# EAGLE design untitled (EAGLE 6.3)
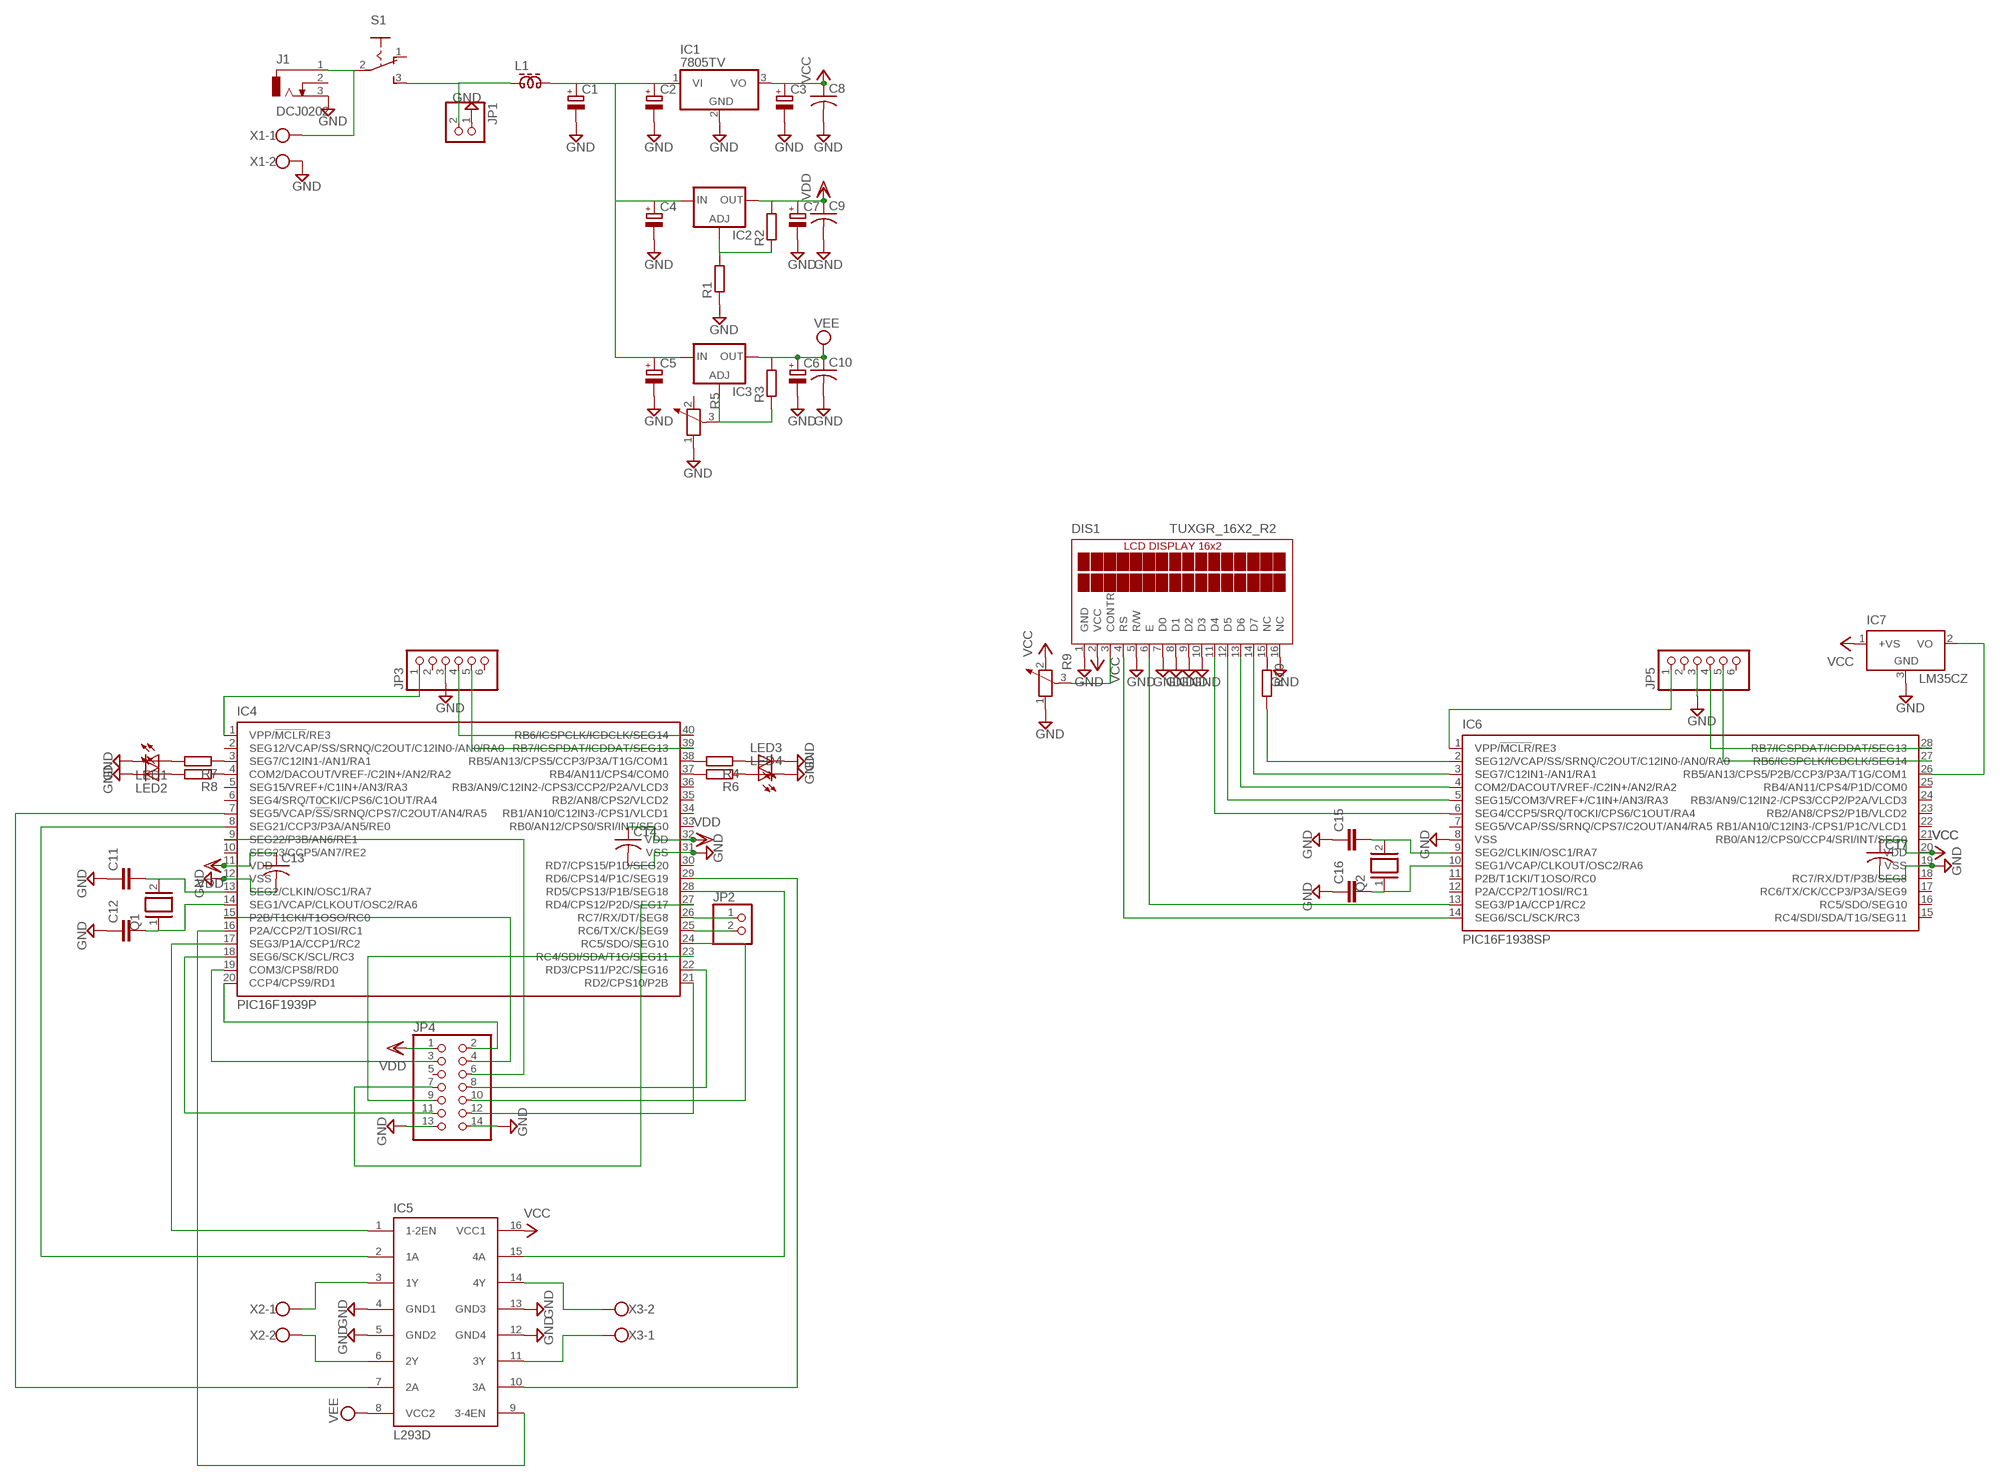
[diagram p0: schematic, sheet 1]

## Parts
C1  CPOL-EUE5-13  [E5-13]
C2  CPOL-EUE3.5-8  [E3,5-8]
C3  CPOL-EUE3.5-8  [E3,5-8]
C4  CPOL-EUE3.5-8  [E3,5-8]
C5  CPOL-EUE3.5-8  [E3,5-8]
C6  CPOL-EUE5-13  [E5-13]
C7  CPOL-EUE3.5-8  [E3,5-8]
C8  C-US050-030X075  [C050-030X075]
C9  C-US050-030X075  [C050-030X075]
C10  C-US050-030X075  [C050-030X075]
C11  C-EU025-025X050  [C025-025X050]
C12  C-EU025-025X050  [C025-025X050]
C13  C-US050-030X075  [C050-030X075]
C14  C-US050-030X075  [C050-030X075]
C15  C-EU025-025X050  [C025-025X050]
C16  C-EU025-025X050  [C025-025X050]
C17  C-US050-030X075  [C050-030X075]
DIS1  TUXGR_16X2_R2  [TUXGR_16X2_R2]
IC1  7805TV  [TO220V]
IC2  LM317TS  [317TS]
IC3  LM317TS  [317TS]
IC4  PIC16F1939P  [DIL40]
IC5  L293D  [DIL16]
IC6  PIC16F1938SP  [DIL28-3]
IC7  LM35CZ  [TO92]
J1  DCJ0202  [DCJ0202]
JP1  PINHD-1X2  [1X02]
JP2  PINHD-1X2  [1X02]
JP3  PINHD-1X6  [1X06]
JP4  PINHD-2X7  [2X07]
JP5  PINHD-1X6  [1X06]
L1  ZD60820512  [ZD6-2W5]
LED1  LED5MM  [LED5MM]
LED2  LED5MM  [LED5MM]
LED3  LED5MM  [LED5MM]
LED4  LED5MM  [LED5MM]
Q1  XTAL/S  [QS]
Q2  XTAL/S  [QS]
R1  R-EU_0207/10  [0207/10]
R2  R-EU_0207/10  [0207/10]
R3  R-EU_0207/10  [0207/10]
R4  R-EU_0207/10  [0207/10]
R5  POTENTIOMETER_PT-10  [PT-10]
R6  R-EU_0207/10  [0207/10]
R7  R-EU_0207/10  [0207/10]
R8  R-EU_0207/10  [0207/10]
R9  POTENTIOMETER_PT-10  [PT-10]
R10  R-EU_0207/10  [0207/10]
S1  255SB  [255SB]
X1  W237-102  [W237-102]
X2  W237-102  [W237-102]
X3  W237-102  [W237-102]

## Nets
GND: C1.- C2.- C3.- C4.- C5.- C6.- C7.- C8.2 C9.2 C10.2 C11.1 C12.1 C13.2 C14.2 C15.1 C16.1 C17.2 DIS1.1(GND) DIS1.5(R/W) DIS1.7(D0) DIS1.8(D1) DIS1.9(D2) DIS1.10(D3) DIS1.16(NC) IC1.2(GND) IC4.12(VSS) IC4.31(VSS) IC5.4(GND1) IC5.5(GND2) IC5.12(GND4) IC5.13(GND3) IC6.8(VSS) IC6.19(VSS) IC7.3(GND) J1.3 JP1.1 JP3.3 JP4.13 JP4.14 JP5.3 LED1.K(C) LED2.K(C) LED3.K(C) LED4.K(C) R1.1 R5.1 R9.1 X1.2
N$1: JP1.2 L1.1 S1.3(S)
N$2: IC4.17(SEG3/P1A/CCP1/RC2) IC5.1(1-2EN)
N$3: IC3.1(ADJ) R3.1 R5.3
N$4: J1.1 S1.2(P) X1.1
N$5: C1.+ C2.+ C4.+ C5.+ IC1.1(VI) IC2.3(IN) IC3.3(IN) L1.2
N$6: IC4.26(RC7/RX/DT/SEG8) JP2.1
N$7: IC4.25(RC6/TX/CK/SEG9) JP2.2
N$8: IC2.1(ADJ) R1.2 R2.1
N$9: IC4.24(RC5/SDO/SEG10) JP4.10
N$10: IC4.1(VPP/!MCLR!/RE3) JP3.1
N$11: IC4.40(RB6/ICSPCLK/ICDCLK/SEG14) JP3.4
N$12: IC4.39(RB7/ICSPDAT/ICDDAT/SEG13) JP3.5
N$13: C12.2 IC4.14(SEG1/VCAP/CLKOUT/OSC2/RA6) Q1.1
N$14: C11.2 IC4.13(SEG2/CLKIN/OSC1/RA7) Q1.2
N$15: IC4.23(RC4/SDI/SDA/T1G/SEG11) JP4.9
N$16: IC4.18(SEG6/SCK/SCL/RC3) JP4.11
N$17: IC4.16(P2A/CCP2/T1OSI/RC1) IC5.9(3-4EN)
N$18: IC4.20(CCP4/CPS9/RD1) JP4.2
N$19: IC4.19(COM3/CPS8/RD0) JP4.3
N$20: IC4.15(P2B/T1CKI/T1OSO/RC0) JP4.4
N$21: IC4.9(SEG22/P3B/AN6/RE1) JP4.6
N$22: IC4.27(RD4/CPS12/P2D/SEG17) JP4.7
N$23: IC4.21(RD2/CPS10/P2B) JP4.12
N$24: IC4.22(RD3/CPS11/P2C/SEG16) JP4.8
N$25: IC4.38(RB5/AN13/CPS5/CCP3/P3A/T1G/COM1) R4.2
N$26: IC4.37(RB4/AN11/CPS4/COM0) R6.2
N$27: IC4.3(SEG7/C12IN1-/AN1/RA1) R7.1
N$28: LED1.A R7.2
N$29: IC4.4(COM2/DACOUT/VREF-/C2IN+/AN2/RA2) R8.1
N$30: LED2.A R8.2
N$31: LED3.A R4.1
N$32: LED4.A R6.1
N$33: IC6.1(VPP/!MCLR!/RE3) JP5.1
N$34: IC4.28(RD5/CPS13/P1B/SEG18) IC5.15(4A)
N$35: IC4.29(RD6/CPS14/P1C/SEG19) IC5.10(3A)
N$36: IC4.8(SEG21/CCP3/P3A/AN5/RE0) IC5.2(1A)
N$37: IC4.7(SEG5/VCAP/!SS!/SRNQ/CPS7/C2OUT/AN4/RA5) IC5.7(2A)
N$38: IC5.3(1Y) X2.1
N$39: IC5.6(2Y) X2.2
N$40: IC5.14(4Y) X3.2
N$41: IC5.11(3Y) X3.1
N$42: IC6.28(RB7/ICSPDAT/ICDDAT/SEG13) JP5.4
N$43: IC6.27(RB6/ICSPCLK/ICDCLK/SEG14) JP5.5
N$44: C16.2 IC6.10(SEG1/VCAP/CLKOUT/OSC2/RA6) Q2.1
N$45: IC6.26(RB5/AN13/CPS5/P2B/CCP3/P3A/T1G/COM1) IC7.2(VO)
N$46: IC6.2(SEG12/VCAP/SS/SRNQ/C2OUT/C12IN0-/AN0/RA0) R10.2
N$47: DIS1.3(CONTR) R9.3
N$48: DIS1.14(D7) IC6.3(SEG7/C12IN1-/AN1/RA1)
N$49: DIS1.13(D6) IC6.4(COM2/DACOUT/VREF-/C2IN+/AN2/RA2)
N$50: DIS1.12(D5) IC6.5(SEG15/COM3/VREF+/C1IN+/AN3/RA3)
N$51: DIS1.11(D4) IC6.6(SEG4/CCP5/SRQ/T0CKI/CPS6/C1OUT/RA4)
N$52: DIS1.6(E) IC6.13(SEG3/P1A/CCP1/RC2)
N$53: DIS1.4(RS) IC6.14(SEG6/SCL/SCK/RC3)
N$54: DIS1.15(NC) R10.1
N$56: C15.2 IC6.9(SEG2/CLKIN/OSC1/RA7) Q2.2
VCC: C3.+ C8.1 C17.1 DIS1.2(VCC) IC1.3(VO) IC5.16(VCC1) IC6.20(VDD) IC7.1(+VS) R9.2
VDD: C7.+ C9.1 C13.1 C14.1 IC2.2(OUT) IC4.11(VDD) IC4.32(VDD) JP4.1 R2.2
VEE: C6.+ C10.1 IC3.2(OUT) IC5.8(VCC2) R3.2
Unconnected: IC4.2(SEG12/VCAP/SS/SRNQ/C2OUT/C12IN0-/AN0/RA0) IC4.5(SEG15/VREF+/C1IN+/AN3/RA3) IC4.6(SEG4/SRQ/T0CKI/CPS6/C1OUT/RA4) IC4.10(SEG23/CCP5/AN7/RE2) IC4.30(RD7/CPS15/P1D/SEG20) IC4.33(RB0/AN12/CPS0/SRI/INT/SEG0) IC4.34(RB1/AN10/C12IN3-/CPS1/VLCD1) IC4.35(RB2/AN8/CPS2/VLCD2) IC4.36(RB3/AN9/C12IN2-/CPS3/CCP2/P2A/VLCD3) IC6.7(SEG5/VCAP/SS/SRNQ/CPS7/C2OUT/AN4/RA5) IC6.11(P2B/T1CKI/T1OSO/RC0) IC6.12(P2A/CCP2/T1OSI/RC1) IC6.15(RC4/SDI/SDA/T1G/SEG11) IC6.16(RC5/SDO/SEG10) IC6.17(RC6/TX/CK/CCP3/P3A/SEG9) IC6.18(RC7/RX/DT/P3B/SEG8) IC6.21(RB0/AN12/CPS0/CCP4/SRI/INT/SEG0) IC6.22(RB1/AN10/C12IN3-/CPS1/P1C/VLCD1) IC6.23(RB2/AN8/CPS2/P1B/VLCD2) IC6.24(RB3/AN9/C12IN2-/CPS3/CCP2/P2A/VLCD3) IC6.25(RB4/AN11/CPS4/P1D/COM0) J1.2 JP3.2 JP3.6 JP4.5 JP5.2 JP5.6 R5.2 S1.1(O)

## Library data of the parts
C1-C7 = rcl:CPOL-EU: POLARIZED CAPACITOR, European symbol
C8-C10 C13 C14 C17 = resistor:C-US: CAPACITOR, American symbol
C11 C12 C15 C16 = rcl:C-EU: CAPACITOR, European symbol
DIS1 = display-lcd:TUXGR_16X2_R2: Tuxgraphics LCD display 16x2 characters reflective, without background light Source: tuxgr_12x2_r2.pdf; OC_FARNELL: unknown; OC_NEWARK: unknown
IC1 = linear:78*: Positive LDO VOLTAGE REGULATOR Source: http://ww1.microchip.com/downloads/en/DeviceDoc/21983A.pdf
IC2 IC3 = v-reg:LM317TS: VOLTAGE REGULATOR
IC4 = microchip:PIC16F193*?: Flash-Based, 8-Bit CMOS Microcontrollers wtih LCD Driver and nanoWatt XLP Technology Auto generated by make-symbol-device-package-bsdl.ulp Rev. 33 Source: http://ww1.microchip.com/downloads/en/DeviceDoc/41364D.pdf; MPN: PIC16F1939-I/P; OC_FARNELL: 1755832; OC_NEWARK: 08R1958
IC5 = st-microelectronics:L293D: PUSH-PULL 4 CHANNEL DRIVER; MPN: L293D; OC_FARNELL: 9589619; OC_NEWARK: 56P8249
IC6 = microchip:PIC16F19*: Flash-Based, 8-Bit CMOS Microcontrollers wtih LCD Driver and nanoWatt XLP Technology Auto generated by make-symbol-device-package-bsdl.ulp Rev. 33 Source: http://ww1.microchip.com/downloads/en/DeviceDoc/41364D.pdf; MPN: PIC16F1938-I/SP; OC_FARNELL: 1755829; OC_NEWARK: 08R1949
IC7 = lm35:LM35: Single-Supply Centigrade Temperature Sensor Vout = (10mV/°C x Temp °C) +5mmmV Source: http://www.national.com/ds/LM/LM35.pdf
J1 = con-jack:DCJ0202: DC POWER JACK Source: DCJ0202.pdf; OC_FARNELL: unknown; OC_NEWARK: unknown
JP1 JP2 = pinhead:PINHD-1X2: PIN HEADER
JP3 JP5 = pinhead:PINHD-1X6: PIN HEADER
JP4 = pinhead:PINHD-2X7: PIN HEADER
L1 = inductor-neosid:ZD60820512: WIDE-BAND CHOKE 2.5 windings; OC_FARNELL: unknown; OC_NEWARK: unknown
LED1-LED4 = led:LED: LED OSRAM: - CHIPLED LG R971, LG N971, LY N971, LG Q971, LY Q971, LO R971, LY R971 LH N974, LH R974 LS Q976, LO Q976, LY Q976 LO Q996 - Hyper CHIPLED LW Q18S LB Q993, LB Q99A, LB R99A - SideLED LS A670, LO A670, LY A670, LG A670, LP A670 LB A673, LV A673, LT A673, LW A673 LH A674 LY A675 LS A676, LA A676, LO A676, LY A676, LW A676 LS A679, LY A679, LG A679 - Hyper Micro SIDELED® LS Y876, LA Y876, LO Y876, LY Y876 LT Y87S - SmartLED LW L88C, LW L88S LB L89C, LB L89S, LG L890 LS L89K, LO L89K, LY L89K LS L896, LA L896, LO L896, LY L896 - TOPLED LS T670, LO T670, LY T670, LG T670, LP T670 LSG T670, LSP T670, LSY T670, LOP T670, LYG T670 LG T671, LOG T671, LSG T671 LB T673, LV T673, LT T673, LW T673 LH T674 LS T676, LA T676, LO T676, LY T676, LB T676, LH T676, LSB T676, LW T676 LB T67C, LV T67C, LT T67C, LS T67K, LO T67K, LY T67K, LW E67C LS E67B, LA E67B, LO E67B, LY E67B, LB E67C, LV E67C, LT E67C LW T67C LS T679, LY T679, LG T679 LS T770, LO T770, LY T770, LG T770, LP T770 LB T773, LV T773, LT T773, LW T773 LH T774 LS E675, LA E675, LY E675, LS T675 LS T776, LA T776, LO T776, LY T776, LB T776 LHGB T686 LT T68C, LB T68C - Hyper Mini TOPLED® LB M676 - Mini TOPLED Santana® LG M470 LS M47K, LO M47K, LY M47K Source: http://www.osram.convergy.de LUXEON: - LUMILED® LXK2-PW12-R00, LXK2-PW12-S00, LXK2-PW14-U00, LXK2-PW14-V00 LXK2-PM12-R00, LXK2-PM12-S00, LXK2-PM14-U00 LXK2-PE12-Q00, LXK2-PE12-R00, LXK2-PE12-S00, LXK2-PE14-T00, LXK2-PE14-U00 LXK2-PB12-K00, LXK2-PB12-L00, LXK2-PB12-M00, LXK2-PB14-N00, LXK2-PB14-P00, LXK2-PB14-Q00 LXK2-PR12-L00, LXK2-PR12-M00, LXK2-PR14-Q00, LXK2-PR14-R00 LXK2-PD12-Q00, LXK2-PD12-R00, LXK2-PD12-S00 LXK2-PH12-R00, LXK2-PH12-S00 LXK2-PL12-P00, LXK2-PL12-Q00, LXK2-PL12-R00 Source: www.luxeon.com KINGBRIGHT: KA-3528ASYC Source: www.kingbright.com
Q1 Q2 = special:XTAL/S: CRYSTAL
R1-R4 R6-R8 R10 = resistor:R-EU_: RESISTOR, European symbol
R5 R9 = rcl:POTENTIOMETER_: Potentiometer
S1 = switch:255SB: SLIDING SWITCH Distributor Buerklin, 11G810
X1-X3 = con-wago-500:W237-102: WAGO SCREW CLAMP; MPN: 237-102; OC_FARNELL: unknown; OC_NEWARK: 70K9898

## Board
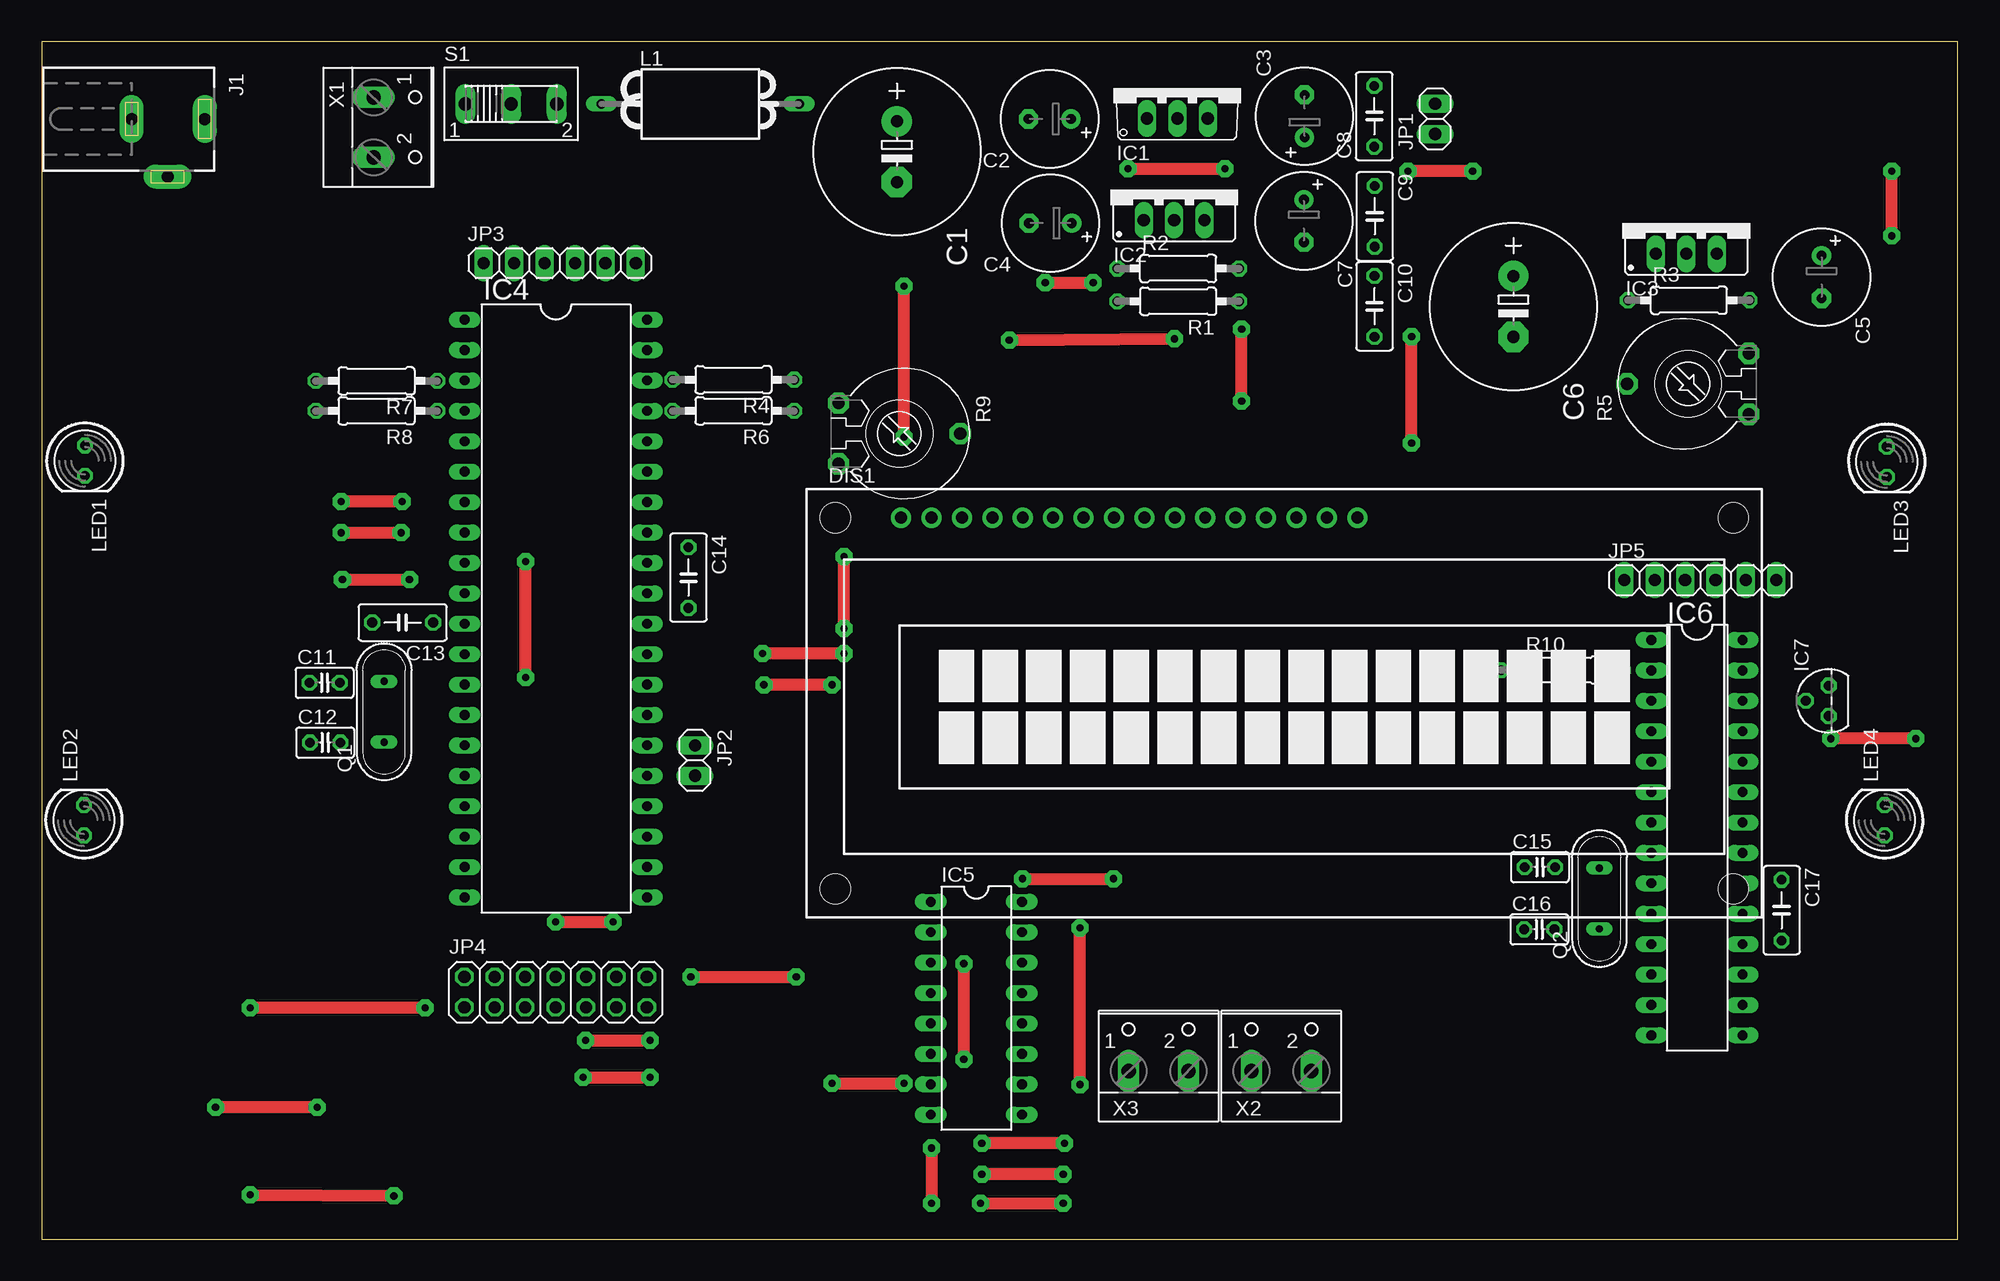
[diagram p1: board, top side]
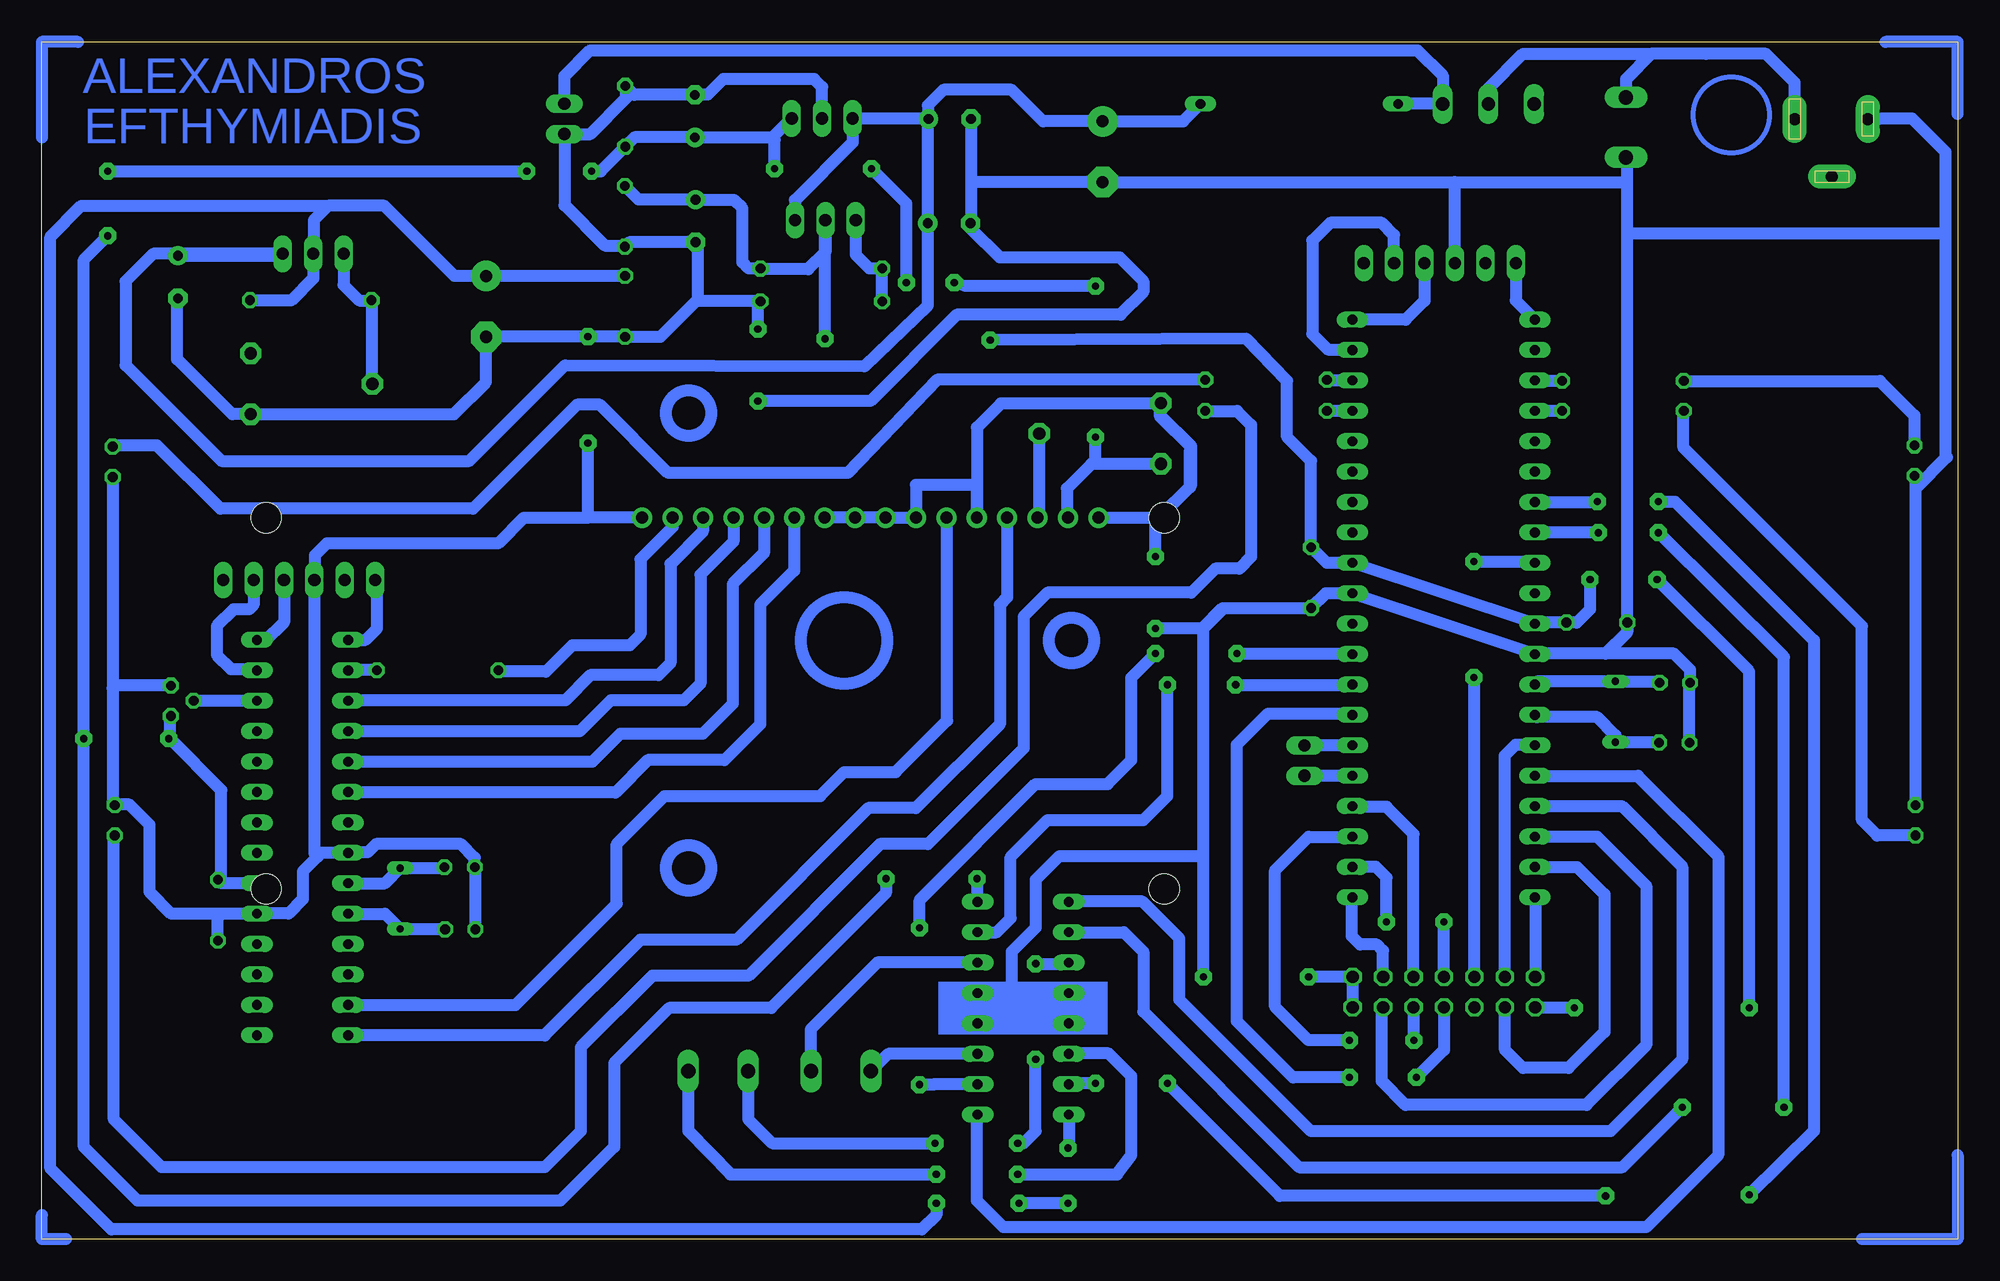
[diagram p2: board, bottom side, seen from below]

Size 160 x 100 mm. Coordinates in mm from the lower left corner, seen from the top.
Outline: 0,0 160,0 160,100 0,100 0,0
Copper layers (1*16): Top 0.035mm / dielectric 1.5mm / Bottom 0.035mm
Design rules "default": minimum track width 10mil, minimum drill 24mil, track to track 8mil, track to pad 8mil, pad to pad 8mil, via to via 8mil, smd to smd 8mil, copper to edge 40mil, drill to drill 8mil, minimum pad ring 10mil, minimum via ring 8mil, stop-mask expansion 4mil, vias tented up to drill 0mil, thermal gap 10mil

### Footprints (pad centres in the part's own frame; a part is rotated, then mirrored left to right if it is on the bottom)
E5-13 = drill 1.016 pad 2.54: + -2.54,0 | drill 1.016 pad 2.54 octagon: - 2.54,0
E3,5-8 = drill 0.813 pad 1.6: + -1.778,0 | drill 0.813 pad 1.6 octagon: - 1.778,0
C050-030X075 = drill 0.813 octagon: 1 -2.54,0; 2 2.54,0
C025-025X050 = drill 0.813 octagon: 1 -1.27,0; 2 1.27,0
TUXGR_16X2_R2 = drill 1 pad 1.676: 1 -32,15.5; 2 -29.46,15.5; 3 -26.92,15.5; 4 -24.38,15.5; 5 -21.84,15.5; 6 -19.3,15.5; 7 -16.76,15.5; 8 -14.22,15.5; 9 -11.68,15.5; 10 -9.14,15.5; 11 -6.6,15.5; 12 -4.06,15.5; 13 -1.52,15.5; 14 1.02,15.5; 15 3.56,15.5; 16 6.1,15.5 | hole 2.5: -37.5,-15.5; 37.5,-15.5; -37.5,15.5; 37.5,15.5
TO220V = drill 1.016 long: 1 -2.54,-2.54; 2 0,-2.54; 3 2.54,-2.54
317TS = drill 1.016 long: 1 -2.54,-2.54; 2 0,-2.54; 3 2.54,-2.54
DIL40 = drill 0.813 long: 1 -24.13,-7.62; 2 -21.59,-7.62; 3 -19.05,-7.62; 4 -16.51,-7.62; 5 -13.97,-7.62; 6 -11.43,-7.62; 7 -8.89,-7.62; 8 -6.35,-7.62; 9 -3.81,-7.62; 10 -1.27,-7.62; 11 1.27,-7.62; 12 3.81,-7.62; 13 6.35,-7.62; 14 8.89,-7.62; 15 11.43,-7.62; 16 13.97,-7.62; 17 16.51,-7.62; 18 19.05,-7.62; 19 21.59,-7.62; 20 24.13,-7.62; 21 24.13,7.62; 22 21.59,7.62; 23 19.05,7.62; 24 16.51,7.62; 25 13.97,7.62; 26 11.43,7.62; 27 8.89,7.62; 28 6.35,7.62; 29 3.81,7.62; 30 1.27,7.62; 31 -1.27,7.62; 32 -3.81,7.62; 33 -6.35,7.62; 34 -8.89,7.62; 35 -11.43,7.62; 36 -13.97,7.62; 37 -16.51,7.62; 38 -19.05,7.62; 39 -21.59,7.62; 40 -24.13,7.62
DIL16 = drill 0.813 long: 1 -8.89,-3.81; 2 -6.35,-3.81; 3 -3.81,-3.81; 4 -1.27,-3.81; 5 1.27,-3.81; 6 3.81,-3.81; 7 6.35,-3.81; 8 8.89,-3.81; 9 8.89,3.81; 10 6.35,3.81; 11 3.81,3.81; 12 1.27,3.81; 13 -1.27,3.81; 14 -3.81,3.81; 15 -6.35,3.81; 16 -8.89,3.81
DIL28-3 = drill 0.813 long: 1 -16.51,-3.81; 2 -13.97,-3.81; 3 -11.43,-3.81; 4 -8.89,-3.81; 5 -6.35,-3.81; 6 -3.81,-3.81; 7 -1.27,-3.81; 8 1.27,-3.81; 9 3.81,-3.81; 10 6.35,-3.81; 11 8.89,-3.81; 12 11.43,-3.81; 13 13.97,-3.81; 14 16.51,-3.81; 15 16.51,3.81; 16 13.97,3.81; 17 11.43,3.81; 18 8.89,3.81; 19 6.35,3.81; 20 3.81,3.81; 21 1.27,3.81; 22 -1.27,3.81; 23 -3.81,3.81; 24 -6.35,3.81; 25 -8.89,3.81; 26 -11.43,3.81; 27 -13.97,3.81; 28 -16.51,3.81
TO92 = drill 0.813 octagon: 1 -1.27,0; 2 0,1.905; 3 1.27,0
DCJ0202 = drill 1 pad 2 long: 1 0,3.1; 2 4.8,0; 3 0,-3
1X02 = drill 1.016 long: 1 -1.27,0; 2 1.27,0
1X06 = drill 1.016 long: 1 -6.35,0; 2 -3.81,0; 3 -1.27,0; 4 1.27,0; 5 3.81,0; 6 6.35,0
2X07 = drill 1.016 octagon: 1 -7.62,-1.27; 2 -7.62,1.27; 3 -5.08,-1.27; 4 -5.08,1.27; 5 -2.54,-1.27; 6 -2.54,1.27; 7 0,-1.27; 8 0,1.27; 9 2.54,-1.27; 10 2.54,1.27; 11 5.08,-1.27; 12 5.08,1.27; 13 7.62,-1.27; 14 7.62,1.27
ZD6-2W5 = drill 0.8 long: 1 -8.255,0; 2 8.255,0
LED5MM = drill 0.813 octagon: A -1.27,0; K 1.27,0
QS = drill 0.61 long: 1 -2.54,0; 2 2.54,0
0207/10 = drill 0.813 octagon: 1 -5.08,0; 2 5.08,0
PT-10 = drill 1.016 pad 1.778 octagon: 1 -2.54,-5.08; 2 2.54,-5.08; 3 0,5.08
255SB = drill 1.118 long: 1 -3.81,0; 2 0,0; 3 3.81,0
W237-102 = drill 1.194 long: 1 -2.5,-1.27; 2 2.5,-1.27

### Placement (x,y rotation side)
C1  71.41,90.83 270 top
C2  84.17,93.56 180 top
C3  105.46,93.8 90 top
C4  84.23,84.86 180 top
C5  148.64,80.36 270 top
C6  122.9,77.9 270 top
C7  105.4,85.05 270 top
C8  111.28,93.79 90 top
C9  111.32,85.43 270 top
C10  111.3,77.91 270 top
C11  23.61,46.47 0 top
C12  23.66,41.47 0 top
C13  30.13,51.5 180 top
C14  54,55.25 270 top
C15  125.11,31.07 0 top
C16  125.06,25.87 0 top
C17  145.3,27.47 270 top
DIS1  103.76,44.75 0 top
IC1  94.83,96.15 0 top
IC2  94.57,87.64 0 top
IC3  137.34,84.84 0 top
IC4  42.93,52.67 270 top
IC5  78.04,19.28 270 top
IC6  138.24,33.53 270 top
IC7  149.23,44.96 90 top
J1  10.5,93.56 270 top
JP1  116.36,93.58 90 top
JP2  54.54,39.97 270 top
JP3  43.25,81.52 0 top
JP4  42.9,20.63 0 top
JP5  138.51,55.04 0 top
L1  54.98,94.83 0 top
LED1  3.59,65.02 270 top
LED2  3.51,34.98 90 top
LED3  154.09,64.92 270 top
LED4  153.91,34.98 90 top
Q1  28.58,44.05 90 top
Q2  130.08,28.45 90 top
R1  94.9,78.33 180 top
R2  94.9,81.07 0 top
R3  137.55,78.42 0 top
R4  57.75,71.78 180 top
R5  137.48,71.44 90 top
R6  57.75,69.18 180 top
R7  27.95,71.68 180 top
R8  27.95,69.18 180 top
R9  71.62,67.29 270 top
R10  126.95,47.52 0 top
S1  39.19,94.83 0 top
X1  28.97,92.86 270 top
X2  103.52,15.31 0 top
X3  93.26,15.31 0 top

### Tracks (layer width: path | path; a pad name or v marks a point on that pad's centre or on a via)
GND  (via drill 0.6 pad 1.42)
  Top 1: v54.2,21.9 v63,21.9 | v67,51 v67,57 | v114.4,66.5 v114.4,75.37 | v100.2,70 v100.2,76
  Bottom 1: 82.39,88 C2.- 82.39,84.39 80,82 70,82 68,80 68,79.1 69.9,77.2 83.6,77.2 90.8,70 v100.2,70 | 82.39,88 82.39,84.92 C4.- | 82.39,88 82.1,88.29 C1.- 42,88.29 | 105.35,78.35 108.33,75.37 C10.2 v114.4,75.37 C6.- 122.9,71.6 125.6,68.9 R5.1 144.1,68.9 148.7,73.5 148.7,78.52 C5.- | 105.35,78.35 105.2,78.5 105.2,83.07 C7.- 110.94,83.27 C9.2 111.43,83 113,83 116.36,86.36 JP1.1 114.19,92.31 111.2,95.3 111.2,96.25 C8.2 110.53,95.58 C3.- 105.44,95.6 104.4,95.6 103.1,96.9 95.5,96.9 94.83,96.23 IC1.2 | 105.35,78.35 105.33,78.33 R1.1 100.2,78.11 v100.2,76 | C13.2 27.59,50.71 27.6,50.7 | 29.4,48.9 35.27,48.9 | 35.27,48.9 IC4.12 IC4.31 | IC4.31 52.77,53.94 C14.2 61.4,52.7 | C12.1 22.39,46.42 C11.1 22.34,47.54 23.7,48.9 29.4,48.9 | JP4.13 JP4.14 v54.2,21.9 | IC4.31 35.4,48.9 35.27,48.9 | 29.4,48.9 27.6,50.7 | 27.6,50.7 27.6,84 | 27.6,84 27.6,88 | 27.6,88 27.6,90.26 X1.2 | IC5.4 79,20.55 | 79,20.55 IC5.13 IC5.12 | IC5.5 IC5.4 | v63,21.9 63,32 | 63,32 63,51 | 63,51 63,51.1 61.4,52.7 | IC5.4 76.95,20.55 77,20.6 | 63,32 75,32 77,30 77,26 79,24 79,20.55 | LED1.K 3.51,63.67 LED2.K 3.51,62.69 0.9,65.3 1,65.4 1,84 | J1.3 7,93.56 | 7,93.56 6.56,93.56 | 1,84 27.6,84 | LED3.K 154.09,46 | 154.09,46 154.09,36.43 LED4.K 153.86,36.3 152.7,36.3 151,34.6 151,29 149.18,27.18 145,27.18 | 145,27.18 IC6.19 142.03,27.2 139.4,27.2 138.2,28.4 138.2,30.7 136.95,31.95 | 136.95,31.95 136.64,32.26 IC6.8 134.39,32.3 132.8,32.3 132.1,33 125,33 123.84,31.84 C15.1 123.79,31.02 C16.1 | 136.95,31.95 137.24,32.24 JP5.3 137.2,55.08 137.2,57.1 136.2,58.1 121.9,58.1 119.75,60.25 114.4,60.25 | C17.2 145.3,26.88 145,27.18 | IC7.3 153.86,46.23 154.09,46
  Bottom 1: 42,88.29 27.89,88.29 27.6,88 | JP3.3 41.98,88.27 42,88.29 | 1,84 1,90.8 3.8,93.6 6.96,93.6 7,93.56 | DIS1.10 DIS1.9 DIS1.8 DIS1.7 | 86.86,60.39 DIS1.7 | 67,60.25 66.75,60.25 | 66.75,60.25 64,63 64,66 | 64,66 64,66.1 | 64,66.1 66.6,68.7 66.6,68.8 | 66.6,69.7 66.6,69.77 R9.1 | DIS1.1 67,60.25 | 66.75,60.25 66.65,60.25 64.1,62.8 64.1,65.9 64,66 | 64,66.1 64,66.2 66.6,68.8 | 66.6,68.8 66.6,69.7 | 66.6,69.7 66.5,69.8 79.9,69.8 81.9,67.8 81.9,60.27 DIS1.5 81.92,62.92 82,63 87,63 DIS1.7 | 61.4,52.7 61.4,52.6 63,51 | 63,51 v67,51 | v67,57 67,60.25 | DIS1.16 114.4,60.25 | 114.4,60.25 v114.4,66.5
N$1
  Bottom 1: L1.1 S1.3 43,97.2 45.1,99.3 114.2,99.3 116.36,97.14 JP1.2
N$2
  Bottom 1: IC4.17 28.06,36.16 23,31.1 23,15 29,9 54,9 65,20 65,25.1 68.1,28.2 74.2,28.2 IC5.1
N$3
  Bottom 1: R5.3 132.47,71.51 R3.1 132.49,78.4 133.5,78.4 134.8,79.7 IC3.1
N$4
  Bottom 1: J1.1 13.6,96.6 16,99 21,99 25.6,99 | 25.6,99 27.7,96.9 X1.1 | S1.2 39.19,96.11 36.3,99 25.6,99
N$5
  Bottom 1: L1.2 64.69,93.37 C1.+ 76.37,93.37 79,96 84.7,96 86,94.7 86,93.61 C2.+ | C2.+ 86.01,93.5 C4.+ 86,78 91.3,72.9 116.3,73 124.3,65 145,65 153,73 153,80 150.7,82.3 IC3.3 140.04,82.14 C5.+ | C2.+ 86,93.61 IC1.1 92.29,91.61 97.1,86.8 IC2.3
N$6
  Bottom 1: IC4.26 JP2.1
N$7
  Bottom 1: IC4.25 JP2.2
N$8
  Bottom 1: IC2.1 92.03,82.23 90.9,81.1 89.85,81.1 R2.1 R1.2
N$9
  Bottom 1: JP4.10 45.44,33.84 47.7,36.1 50.49,36.1 IC4.24
N$10
  Bottom 1: JP3.1 36.9,78.39 IC4.1
N$11
  Bottom 1: JP3.4 44.52,78.38 46.1,76.8 IC4.40
N$12
  Bottom 1: JP3.5 47.06,83.86 48.1,84.9 52.4,84.9 53.9,83.4 53.9,75.6 52.6,74.3 50.59,74.3 IC4.39
N$13
  Bottom 1: IC4.14 35.13,43.6 30.1,43.6 28.58,42.08 Q1.1 28.54,41.47 C12.2
N$14
  Bottom 1: IC4.13 35.04,46.59 Q1.2 25,46.59 C11.2
N$15  (via drill 0.6 pad 1.42)
  Top 1: v45.4,16.6 v50.8,16.6
  Bottom 1: JP4.9 45.44,16.64 v45.4,16.6 | v50.8,16.6 54.2,16.6 57,19.4 57,30.8 54.2,33.6 50.57,33.6 IC4.23
N$16
  Bottom 1: IC4.18 30.12,33.62 26,29.5 26,16.2 31,11.2 46.1,11.2 48.1,13.2 48.1,19.24 JP4.11
N$17
  Bottom 1: IC4.16 26.7,38.7 20,32 20,7 26,1 79.7,1 81.9,3.2 81.9,10.34 IC5.9
N$18
  Bottom 1: IC4.20 35.28,28.54 JP4.2
N$19
  Bottom 1: IC4.19 31.78,31.08 29.5,28.8 29.5,17.3 32.5,14.3 36.3,14.3 37.8,15.8 37.8,19.34 JP4.3
N$20
  Bottom 1: JP4.4 37.82,40.38 36.9,41.3 35.37,41.3 IC4.15
N$21  (via drill 0.6 pad 1.42)
  Top 1: v40.4,46.9 v40.4,56.6
  Bottom 1: JP4.6 40.36,46.86 v40.4,46.9 | v40.4,56.6 35.43,56.6 IC4.9
N$22  (via drill 0.6 pad 1.42)
  Top 1: v45.2,13.5 v50.8,13.5
  Bottom 1: JP4.7 42.9,15.8 v45.2,13.5 | v50.8,13.5 55.5,13.5 60.2,18.2 60.2,41.3 57.6,43.9 50.67,43.9 IC4.27
N$23
  Bottom 1: JP4.12 47.98,24.08 48.5,24.6 49.9,24.6 50.6,25.3 50.6,28.49 IC4.21
N$24  (via drill 0.6 pad 1.42)
  Top 1: v42.9,26.5 v47.7,26.5
  Bottom 1: JP4.8 v42.9,26.5 | v47.7,26.5 47.7,30.2 48.6,31.1 50.53,31.1 IC4.22
N$25
  Bottom 1: IC4.38 52.61,71.72 R4.2
N$26
  Bottom 1: IC4.37 R6.2
N$27
  Bottom 1: R7.1 35.27,71.68 IC4.3
N$28
  Bottom 1: R7.2 6.48,71.68 3.6,68.8 LED1.A
N$29
  Bottom 1: R8.1 IC4.4
N$30
  Bottom 1: LED2.A 6.71,33.71 8,35 8,51.2 22.9,66.1 22.9,69.15 R8.2
N$31
  Bottom 1: R4.1 85.22,71.78 92.7,64 107.7,64 113.4,69.7 115.3,69.7 124,61 145.1,61 150.4,66.3 153.98,66.3 LED3.A
N$32
  Bottom 1: LED4.A 154,33.62 154,10 150,6 118,6 115,9 115,16 109,22 101,22 90,33 86,33 78,41 78,52 76,54 64,54 62,56 60,56 59,57 59,68 60.18,69.18 R6.1
N$33
  Bottom 1: IC6.1 132.96,50.04 132,51 132,54.88 JP5.1
N$34  (via drill 0.6 pad 1.42)
  Top 1: v66,46.3 v60.3,46.3
  Bottom 1: IC5.15 80.27,25.63 79.1,26.8 79.1,31.9 76,35 68,35 66,37 v66,46.3 | v60.3,46.3 50.57,46.3 IC4.28
N$35  (via drill 0.6 pad 1.42)
  Top 1: v86.7,12.9 v86.7,26 | v67,48.9 v60.2,48.9
  Bottom 1: IC5.10 85.47,12.93 85.5,12.9 v86.7,12.9 | v86.7,26 86.7,28.3 77,38 71,38 69,40 69,46.9 v67,48.9 | v60.2,48.9 50.59,48.9 IC4.29
N$36  (via drill 0.6 pad 1.42)
  Top 1: v23,11 v14.5,11 | v25,59 v30,59
  Bottom 1: IC5.2 69.63,25.63 68,24 68,19 55,6 28,6 v23,11 | v14.5,11 14.5,48.6 v25,59 | v30,59 35.29,59 IC4.8
N$37  (via drill 0.6 pad 1.42)
  Top 1: v30.1,61.6 v25,61.6 | v17.4,3.7 v29.4,3.6 | v66,13 v72,13
  Bottom 1: IC4.7 30.14,61.56 v30.1,61.6 | v25,61.6 23.6,61.6 12,50 12,9 v17.4,3.7 | v29.4,3.6 56.6,3.6 v66,13 | v72,13 74.16,13 IC5.7
N$38  (via drill 0.6 pad 1.42)
  Top 1: v85.4,8 v78.5,8 | v77,15 v77,23
  Bottom 1: X2.1 101.02,10.02 99,8 v85.4,8 | v78.5,8 78,8 77,9 v77,15 | v77,23 74.32,23 IC5.3
N$39  (via drill 0.6 pad 1.42)
  Top 1: v85.3,5.4 v78.5,5.4
  Bottom 1: X2.2 106.02,9.02 102.5,5.4 v85.3,5.4 | v78.5,5.4 70.2,5.4 69,7 69,13.6 70.9,15.5 74.2,15.5 IC5.6
N$40
  Bottom 1: IC5.14 90.21,23.09 95.8,17.5 95.8,14.08 X3.2
N$41
  Bottom 1: IC5.11 89.33,15.47 X3.1
N$42
  Bottom 1: JP5.4 139.78,51.52 141.4,49.9 141.91,49.9 IC6.28
N$43
  Bottom 1: JP5.5 142.32,52.98 142.7,52.6 144,52.6 145.4,51.2 145.4,48.8 144.2,47.6 142.15,47.6 IC6.27
N$44
  Bottom 1: IC6.10 131.35,27.18 Q2.1 126.37,25.91 C16.2
N$45
  Bottom 1: IC6.26 IC7.2
N$46
  Bottom 1: R10.2 134.41,47.52 IC6.2
N$47
  Bottom 1: DIS1.3 76.7,60.39 R9.3
N$48
  Bottom 1: DIS1.14 104.78,59.12 107.5,56.4 107.5,48.1 108.5,47.1 114.2,47.1 116.3,45 134.39,45 IC6.3
N$49
  Bottom 1: DIS1.13 102.24,58.26 105,55.5 105,46.4 106.4,45 112.5,45 115.1,42.4 134.41,42.4 IC6.4
N$50
  Bottom 1: DIS1.12 99.7,57.3 102.3,54.7 102.3,44.7 104.8,42.2 111.7,42.2 113.95,39.95 114,39.9 114.02,39.88 IC6.5
N$51
  Bottom 1: DIS1.11 97.16,55.84 100,53 100,43 103,40 109.4,40 112.1,37.3 134.39,37.3 IC6.6
N$52
  Bottom 1: IC6.13 120.44,19.56 112,28 112,33 108,37 95,37 93,39 88.7,39 84.4,43.3 84.4,60.19 DIS1.6
N$53
  Bottom 1: DIS1.4 79.38,53.62 80,53 80,43 87,36 91,36 102,25 110,25 118,17 134.41,17 IC6.14
N$54
  Bottom 1: DIS1.15 107.32,59.48 110,56.8 110,50.5 110.9,49.6 115.7,49.6 117.9,47.4 121.75,47.4 R10.1
N$55
  Bottom 1: 0,7 0,0 8,0
N$56
  Bottom 1: IC6.9 131.35,29.72 Q2.2 126.46,30.99 C15.2
N$57
  Bottom 1: 0,94 0,100 6,100
N$58
  Bottom 1: 157,100 160,100 160,92
N$59
  Bottom 1: 158,0 160,0 160,2
VCC  (via drill 0.6 pad 1.42)
  Top 1: v81.9,30.1 v89.5,30.1 | v154.5,83.8 v154.5,89.2 | v119.5,89.2 v114.1,89.2 | v156.5,41.8 v149.4,41.8 149.3,41.8 | v72,67 v72,79.6 | v83.8,79.9 v87.8,79.9 | v90.7,89.4 v98.8,89.4
  Bottom 1: 99,92.02 C3.+ 110.51,92.02 C8.1 113.33,89.2 v114.1,89.2 | 99,92.02 98.96,92.02 IC1.3 | IC5.16 81.85,30.05 v81.9,30.1 | v89.5,30.1 89.5,28.9 99.1,19.3 107.6,19.3 112.2,14.7 112.2,7.7 116.7,3.2 152,3.2 156.5,7.7 v156.5,41.8 156.5,81.8 v154.5,83.8 | v154.5,89.2 v119.5,89.2 | IC6.20 145.01,29.72 | 145.01,29.72 C17.1 | 149.3,42 149.3,41.8 145.01,37.51 145.01,29.72 | 149.3,42 149.3,43.62 IC7.1 | v149.4,41.8 149.4,41.9 149.3,42 | DIS1.2 74.4,60.35 74.4,62.7 72.35,64.75 R9.2 72,64.75 v72,67 | v72,79.6 82.9,79.6 v83.8,79.9 | v87.8,79.9 87.8,86.5 v90.7,89.4 | v98.8,89.4 98.8,91.82 99,92.02
VDD  (via drill 0.6 pad 1.42)
  Top 1: v80.8,75.1 v94.6,75.2 | v32,19.3 v17.4,19.3 | v25.1,55.1 v30.7,55.1
  Bottom 1: C9.1 110.18,86.83 C7.+ 105.37,86.8 102.2,86.8 101.5,86.1 101.5,81.6 100.97,81.07 R2.2 99.91,81 96,81 94.57,82.43 IC2.2 94.6,84.93 v94.6,75.2 | v80.8,75.1 59.4,75.2 56,71.7 56,67 54,65 C14.1 52.69,56.48 IC4.32 IC4.11 35.21,51.5 C13.1 31.8,51.5 30.7,52.6 v30.7,55.1 | JP4.1 32.06,19.36 v32,19.3 | v17.4,19.3 17.4,47.4 v25.1,55.1
VEE  (via drill 0.6 pad 1.42)
  Top 1: v74.3,7.6 v74.3,3 | v78.4,3 v85.3,3
  Bottom 1: C10.1 C6.+ 125.54,80.44 131.4,86.3 136.1,86.3 | R3.2 142.61,78.4 139.2,78.4 137.34,80.26 IC3.2 137.3,82.34 137.3,85.1 136.1,86.3 | IC5.8 74.23,7.67 v74.3,7.6 | v85.3,3 85.3,2 86.5,0.8 154.2,0.8 159.3,5.9 159.3,83.7 156.7,86.3 136.1,86.3 | v74.3,3 v78.4,3
(copper drawn outside any net)
  shapes: Bottom area x1, Bottom circle x5

### Text on the board
Bottom: ALEXANDROS | EFTHYMIADIS